# Altium schematic sheet CPU_JTAG_Power_PLL.SchDoc
size A4 portrait
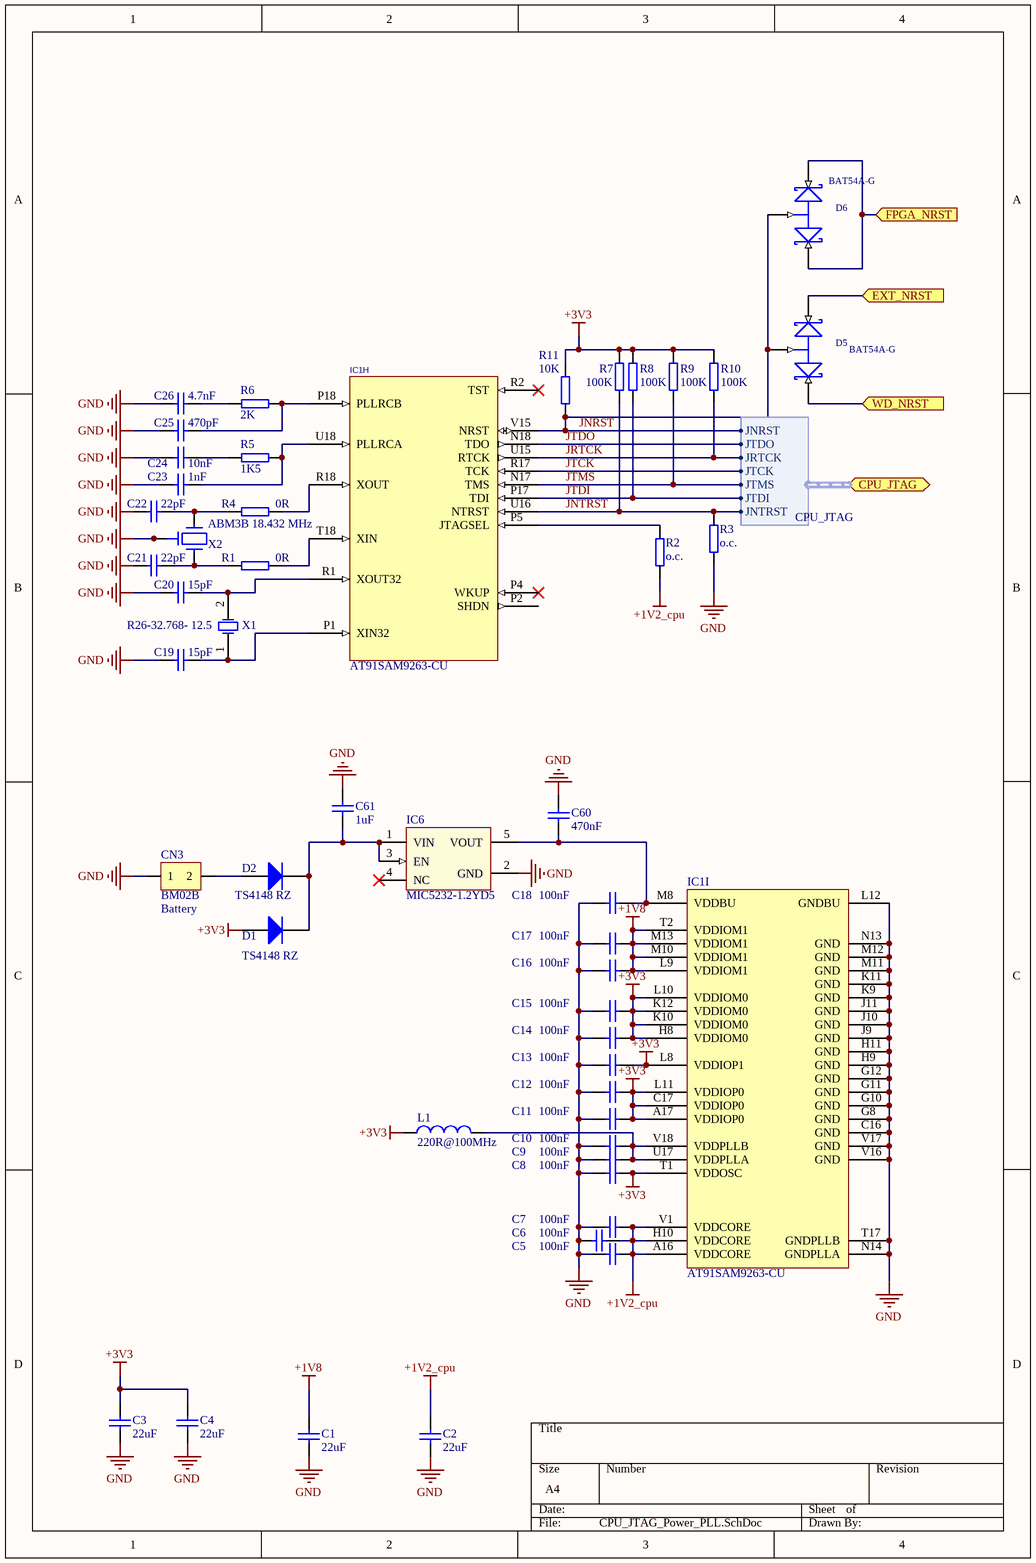
[diagram p0: CPU_JTAG_Power_PLL.SchDoc]

## Parts
(Parts that share a designator on the sheet are numbered #1, #2 ... from top to bottom, then left to right.)
C1  22uF  [CC2012-0805]
C2  22uF  [CC2012-0805]
C3  22uF  [CC2012-0805]
C4  22uF  [CC2012-0805]
C5  100nF  [CC1005-0402]
C6  100nF  [CC1005-0402]
C7  100nF  [CC1005-0402]
C8  100nF  [CC1005-0402]
C9  100nF  [CC1005-0402]
C10  100nF  [CC1005-0402]
C11  100nF  [CC1005-0402]
C12  100nF  [CC1005-0402]
C13  100nF  [CC1005-0402]
C14  100nF  [CC1005-0402]
C15  100nF  [CC1005-0402]
C16  100nF  [CC1005-0402]
C17  100nF  [CC1005-0402]
C18  100nF  [CC1005-0402]
C19  15pF  [CC1005-0402]
C20  15pF  [CC1005-0402]
C21  22pF  [CC1005-0402]
C22  22pF  [CC1005-0402]
C23  1nF  [CC1005-0402]
C24  10nF  [CC1005-0402]
C25  470pF  [CC1005-0402]
C26  4.7nF  [CC1005-0402]
C60  470nF  [CC1005-0402]
C61  1uF  [CC1005-0402]
CN3  BM02B  Comment2: Battery  [SH_CRIMP_1MM_2]
D1  TS4148 RZ  [CC1608-0603]
D2  TS4148 RZ  [CC1608-0603]
D5  BAT54A-G  [SOT23]
D6  BAT54A-G  [SOT23]
IC1#1  AT91SAM9263-CU  [TFBGA324]  (part H of 12)
IC1#2  AT91SAM9263-CU  [TFBGA324]  (part I of 9)
IC6  MIC5232-1.2YD5  [SOT23-5AL]
L1  Impedance: 220R@100MHz  [0603]  (hidden comment: 220R@100MHz Ferrite Bead)
R1  value 0R  [0402]  (hidden comment: Jumper)
R2  o.c.  [0402]
R3  o.c.  [0402]
R4  value 0R  [0402]  (hidden comment: Jumper)
R5  1K5  [0402]
R6  2K  [0402]
R7  100K  [0402]
R8  100K  [0402]
R9  100K  [0402]
R10  100K  [0402]
R11  10k  [0402]
X1  R26-32.768- 12.5  [XTAL_32k]
X2  ABM3B 18.432 MHz  [XTALL_ABM3]

## Ports
CPU_JTAG (harness CPU_JTAG), EXT_NRST (in), FPGA_NRST (in), WD_NRST (in)

## Harnesses
CPU_JTAG: JNRST, JTDO, JRTCK, JTCK, JTMS, JTDI, JNTRST

## Nets
+1V2_cpu: C2.2 C5.1 C6.1 C7.1 IC1#2.A16(VDDCORE) IC1#2.H10(VDDCORE) IC1#2.V1(VDDCORE) R2.2
+1V8: C1.2 C16.1 C17.1 IC1#2.L9(VDDIOM1) IC1#2.M10(VDDIOM1) IC1#2.M13(VDDIOM1) IC1#2.T2(VDDIOM1)
+3V3: C3.2 C4.2 C8.1 C11.1 C12.1 C13.1 C14.1 C15.1 D1.1(A) IC1#2.A17(VDDIOP0) IC1#2.C17(VDDIOP0) IC1#2.H8(VDDIOM0) IC1#2.K10(VDDIOM0) IC1#2.K12(VDDIOM0) IC1#2.L8(VDDIOP1) IC1#2.L10(VDDIOM0) IC1#2.L11(VDDIOP0) IC1#2.T1(VDDOSC) L1.1 R7.2 R8.2 R9.2 R10.2 R11.2
GND: C1.1 C2.1 C3.1 C4.1 C5.2 C6.2 C7.2 C8.2 C9.2 C10.2 C11.2 C12.2 C13.2 C14.2 C15.2 C16.2 C17.2 C18.2 C19.1 C20.1 C21.1 C22.1 C23.1 C24.2 C25.1 C26.1 C60.1 C61.1 CN3.1 IC1#2.C16(GND) IC1#2.G8(GND) IC1#2.G10(GND) IC1#2.G11(GND) IC1#2.G12(GND) IC1#2.H9(GND) IC1#2.H11(GND) IC1#2.J9(GND) IC1#2.J10(GND) IC1#2.J11(GND) IC1#2.K9(GND) IC1#2.K11(GND) IC1#2.L12(GNDBU) IC1#2.M11(GND) IC1#2.M12(GND) IC1#2.N13(GND) IC1#2.N14(GNDPLLA) IC1#2.T17(GNDPLLB) IC1#2.V16(GND) IC1#2.V17(GND) IC6.2(GND) R3.2 X2.2 X2.4
EXT_NRST: D5.2(K2) ; port EXT_NRST
FPGA_NRST: D6.1(K1) D6.2(K2) ; port FPGA_NRST
JNRST: D5.3(A) D6.3(A) IC1#1.V15(NRST) R11.1 ; port CPU_JTAG.JNRST
JNTRST: IC1#1.U16(NTRST) R3.1 R7.1 ; port CPU_JTAG.JNTRST
JRTCK: IC1#1.U15(RTCK) R10.1 ; port CPU_JTAG.JRTCK
JTCK: IC1#1.R17(TCK) ; port CPU_JTAG.JTCK
JTDI: IC1#1.P17(TDI) R8.1 ; port CPU_JTAG.JTDI
JTDO: IC1#1.N18(TDO) ; port CPU_JTAG.JTDO
JTMS: IC1#1.N17(TMS) R9.1 ; port CPU_JTAG.JTMS
WD_NRST: D5.1(K1) ; port WD_NRST
NetC9_1: C9.1 C10.1 IC1#2.U17(VDDPLLA) IC1#2.V18(VDDPLLB) L1.2
NetC18_1: C18.1 C60.2 IC1#2.M8(VDDBU) IC6.5(VOUT)
NetC19_2: C19.2 IC1#1.P1(XIN32) X1.1(OSC1)
NetC20_2: C20.2 IC1#1.R1(XOUT32) X1.2(OSC2)
NetC21_2: C21.2 R1.1 X2.3
NetC22_2: C22.2 R4.1 X2.1
NetC23_2: C23.2 IC1#1.U18(PLLRCA) R5.1
NetC24_1: C24.1 R5.2
NetC25_2: C25.2 IC1#1.P18(PLLRCB) R6.2
NetC26_2: C26.2 R6.1
NetC61_2: C61.2 D1.2(K) D2.2(K) IC6.1(VIN) IC6.3(EN)
NetCN3_2: CN3.2 D2.1(A)
NetIC1#1_P5: IC1#1.P5(JTAGSEL) R2.1
NetIC1#1_R18: IC1#1.R18(XOUT) R4.2
NetIC1#1_T18: IC1#1.T18(XIN) R1.2

Not connected (* = marked no-connect by the designer): IC1#1 P2(SHDN) P4(WKUP)* R2(TST)*; IC6 4(NC)*

## Library data of the parts
C1-C4 = CC0805_22UF_6.3V_20%_X5R: Capacitor; Manufacturer1: TDK; Manufacturer1 PN: C2012X5R0J226M; TC: X5R; Tolerance: ±20%; Voltage: 6.3V; Published: 8-Jun-2000; LatestRevisionDate: 17-Jul-2002; LatestRevisionNote: Re-released for DXP Platform.; PackageReference: RAD-0.3; Publisher: Altium Limited; Distributor1: Digikey; Distributor1 PN: 445-1422-1-ND; Case: 0805; Value: 22uF
C5-C18 = CC0402_100NF_16V_10%_X7R: Capacitor; Manufacturer1: TDK; Manufacturer1 PN: C1005X7R1C104K; TC: X7R; Tolerance: ±10%; Voltage: 16V; Published: 8-Jun-2000; LatestRevisionDate: 17-Jul-2002; LatestRevisionNote: Re-released for DXP Platform.; PackageReference: RAD-0.3; Publisher: Altium Limited; Distributor1: Digikey; Distributor1 PN: 445-4952-1-ND; Case: 0402; Value: 100nF
C19 C20 = CC0402_15PF_50V_5%_NP0: Capacitor; Manufacturer1: TDK; Manufacturer1 PN: C1005C0G1H150J; TC: NP0; Tolerance: ±5%; Voltage: 50V; Published: 8-Jun-2000; LatestRevisionDate: 17-Jul-2002; LatestRevisionNote: Re-released for DXP Platform.; PackageReference: RAD-0.3; Publisher: Altium Limited; Distributor1: Digikey; Distributor1 PN: 445-1237-1-ND; Case: 0402; Value: 15pF
C21 C22 = CC0402_22PF_50V_5%_NP0: Capacitor; Manufacturer1: TDK; Manufacturer1 PN: C1005C0G1H220J; TC: NP0; Tolerance: ±5%; Voltage: 50V; Published: 8-Jun-2000; LatestRevisionDate: 17-Jul-2002; LatestRevisionNote: Re-released for DXP Platform.; PackageReference: RAD-0.3; Publisher: Altium Limited; Distributor1: Digikey; Distributor1 PN: 445-1239-1-ND; Case: 0402; Value: 22pF
C23 = CC0402_1NF_25V_10%_X7R: Capacitor; Manufacturer1: TDK; Manufacturer1 PN: C1005X7R1E102K; TC: X7R; Tolerance: ±10%; Voltage: 25V; Published: 8-Jun-2000; LatestRevisionDate: 17-Jul-2002; LatestRevisionNote: Re-released for DXP Platform.; PackageReference: RAD-0.3; Publisher: Altium Limited; Distributor1: Digikey; Distributor1 PN: 445-4924-1-ND; Case: 0402; Value: 1nF
C24 = CC0402_10NF_25V_10%_X7R: Capacitor; Manufacturer1: TDK; Manufacturer1 PN: C1005X7R1E103K; TC: X7R; Tolerance: ±10%; Voltage: 25V; Published: 8-Jun-2000; LatestRevisionDate: 17-Jul-2002; LatestRevisionNote: Re-released for DXP Platform.; PackageReference: RAD-0.3; Publisher: Altium Limited; Distributor1: Digikey; Distributor1 PN: 445-1260-1-ND; Case: 0402; Value: 10nF
C25 = CC0402_470PF_50V_10%_X7R: Capacitor; Manufacturer1: TDK; Manufacturer1 PN: C1005X7R1H471K; TC: X7R; Tolerance: ±10%; Voltage: 50V; Published: 8-Jun-2000; LatestRevisionDate: 17-Jul-2002; LatestRevisionNote: Re-released for DXP Platform.; PackageReference: RAD-0.3; Publisher: Altium Limited; Distributor1: Digikey; Distributor1 PN: 445-1255-1-ND; Case: 0402; Value: 470pF
C26 = CC0402_4.7NF_25V_10%_X7R: Capacitor; Manufacturer1: TDK; Manufacturer1 PN: C1005X7R1E472K; TC: X7R; Tolerance: ±10%; Voltage: 25V; Published: 8-Jun-2000; LatestRevisionDate: 17-Jul-2002; LatestRevisionNote: Re-released for DXP Platform.; PackageReference: RAD-0.3; Publisher: Altium Limited; Distributor1: Digikey; Distributor1 PN: 445-1259-1-ND; Case: 0402; Value: 4.7nF
C60 = CC0402_470NF_16V_10%_X5R: Capacitor; Manufacturer1: TDK; Manufacturer1 PN: C1005X5R1C474K; TC: X5R; Tolerance: ±10%; Voltage: 16V; Published: 8-Jun-2000; LatestRevisionDate: 17-Jul-2002; LatestRevisionNote: Re-released for DXP Platform.; PackageReference: RAD-0.3; Publisher: Altium Limited; Distributor1: Digikey; Distributor1 PN: 445-4976-1-ND; Case: 0402; Value: 470nF
C61 = CC0402_1UF_16V_10%_X5R: Capacitor; Manufacturer1: TDK; Manufacturer1 PN: C1005X5R1C105K; TC: X5R; Tolerance: ±10%; Voltage: 16V; Published: 8-Jun-2000; LatestRevisionDate: 17-Jul-2002; LatestRevisionNote: Re-released for DXP Platform.; PackageReference: RAD-0.3; Publisher: Altium Limited; Distributor1: Digikey; Distributor1 PN: 445-4978-1-ND; Case: 0402; Value: 1uF
CN3 = CON_SH_CRIMP_1MM_2: RefId: Far/1679127
D1 D2 = Diode: Default Diode; Published: 8-Jun-2000; LatestRevisionDate: 17-Jul-2002; LatestRevisionNote: Re-released for DXP Platform.; PackageDocument: Sep-1996; PackageReference: SMC; Publisher: Altium Limited; Code_JEDEC: DO-214-AB; Value: TS4148 RZ; Distributor1 PN: 8150192; Distributor1: Farnell
D5 D6 = BAT54A.1: Schottky Barrier Double Diode; PACKAGE_INFORMATION: Latest Revision: May-1999; DEVICE: BAT54A-G; PKG_TYPE: SOT23; PUBLISHED: 17-Sep-2003; DATASHEET: Latest Revision: 4-Mar-2002; PACKAGE_REFERENCE: SOT23; PUBLISHER: Altium Limited; Value: BAT54A-G; Distributor1 PN: 641-1319-1-ND; Distributor1: Digikey
IC1#1 IC1#2 = AT91SAM9263: Atmel ARM926 MCU; Supplier: EBV; RefId: AT91SAM9263-CU; Value: AT91SAM9263-CU
IC6 = MIC5232-1.2YD5: 10mA Ultra-Low Quiescent Current uCap LDO; Manufacturer: Micrel; Value: MIC5232-1.2YD5; Distributor1: Digikey; Distributor1 PN: 576-1829-1-ND
L1 = L_FERRITE_BEAD: ferrite bead; Manufacturer1: Murata; Manufacturer1 PN: BLM18KG221SN1D; Current Rating: 2.2A; DCR: 50mOhm; Case: 0603; Distributor1: Digikey; Distributor1 PN: 490-5255-1-ND
R1 R4 = R0402_0R_0.1W_JUMPER: SMD Resistor; Manufacturer1: Panasonic; Manufacturer1 PN: ERJ-2GE0R00X; TCR: 100ppm; Power Rating: 0.1W; Case: 0402; Distributor1: DigiKey; Distributor1 PN: P0.0JCT-ND; Tolerance: Jumper
R2 R3 = R0402_O.C.: SMD Resistor; Case: 0402; Manufacturer1: N/A; Manufacturer1 PN: N/A; Distributor1: N/A; Distributor1 PN: N/A; TCR: N/A; Power Rating: N/A; Tolerance: N/A; Value: o.c.
R5 = R0402_1K5_±1%_0.1W_100PPM: SMD Resistor; Manufacturer1: Panasonic; Manufacturer1 PN: ERJ-2RKF1501X; TCR: 100ppm; Power Rating: 0.1W; Tolerance: ±1%; Case: 0402; Distributor1: DigiKey; Distributor1 PN: P1.50KLCT-ND; Value: 1K5
R6 = R0402_2K_±1%_0.1W_100PPM: SMD Resistor; Manufacturer1: Panasonic; Manufacturer1 PN: ERJ-2RKF2001X; TCR: 100ppm; Power Rating: 0.1W; Tolerance: ±1%; Case: 0402; Distributor1: DigiKey; Distributor1 PN: P2.00KLCT-ND; Value: 2K
R7-R10 = R0402_100K_±1%_0.1W_100PPM: SMD Resistor; Manufacturer1: Panasonic; Manufacturer1 PN: ERJ-2RKF1003X; TCR: 100ppm; Power Rating: 0.1W; Tolerance: ±1%; Case: 0402; Distributor1: DigiKey; Distributor1 PN: P100KLCT-ND; Value: 100K
R11 = R0402_10K_±1%_0.1W_100PPM: SMD Resistor; Manufacturer1: Panasonic; Manufacturer1 PN: ERJ-2RKF1002X; TCR: 100ppm; Power Rating: 0.1W; Tolerance: ±1%; Case: 0402; Distributor1: DigiKey; Distributor1 PN: P10.0KLCT-ND; Value: 10K
X1 = XTAL: Crystal Oscillator; Manufacturer: Raltron; Published: 8-Jun-2000; LatestRevisionDate: 17-Jul-2002; LatestRevisionNote: Re-released for DXP Platform.; PackageReference: R38; Publisher: Altium Limited; Value: R26-32.768- 12.5; Distributor1: Farnell; Distributor1 PN: 1652573
X2 = X_CRYSTAL_SMD_ABM8: Miniature crystal oscillator (ABRACON); Value: ABM3B-18.432MHZ-B2-T; RefId: 1611814; Supplier: Farnell